# Altium schematic sheet preamp.SchDoc
size A4; SheetNumber: 2; SheetTotal: 3
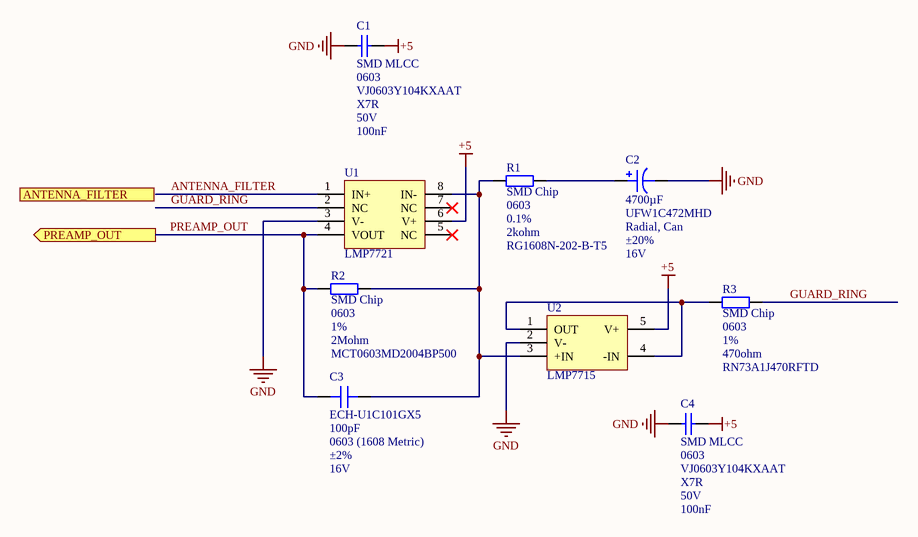
[diagram p0: preamp.SchDoc]

## Parts
C1  SMD MLCC  Size: 0603  Part Number: VJ0603Y104KXAAT  Dielectric: X7R  VoltageRating: 50V  Capacitance: 100nF  [SMD_MLCC_CAPACITOR_0603]
C2  4700µF  Part Number: UFW1C472MHD  Package / Case: Radial, Can  Tolerance: ±20%  Voltage - Rated: 16V  [CAP TH ALUM ELEC D16.00mm S7.50mm H25.00mm]
C3  Part Number: ECH-U1C101GX5  Package / Case: 0603 (1608 Metric)  Tolerance: ±2%  Voltage Rating - DC: 16V  [CAP FILM 0603_1608]  (hidden comment: 100pF)
C4  SMD MLCC  Size: 0603  Part Number: VJ0603Y104KXAAT  Dielectric: X7R  VoltageRating: 50V  Capacitance: 100nF  [SMD_MLCC_CAPACITOR_0603]
R1  SMD Chip  Size: 0603  Tolerance: 0.1%  Resistance: 2kohm  Part Number: RG1608N-202-B-T5  [SMD_CHIP_RESISTOR_0603]
R2  SMD Chip  Size: 0603  Tolerance: 1%  Resistance: 2Mohm  Part Number: MCT0603MD2004BP500  [SMD_CHIP_RESISTOR_0603]
R3  SMD Chip  Size: 0603  Tolerance: 1%  Resistance: 470ohm  Part Number: RN73A1J470RFTD  [SMD_CHIP_RESISTOR_0603]
U1  LMP7721  [LMP7721]
U2  LMP7715  [LMP7715]

## Ports
ANTENNA_FILTER (in), PREAMP_OUT (out)

## Nets
+5: C1.1 C4.1 U1.6(V+) U2.5(V+)
GND: C1.2 C2.2 C4.2 U1.3(V-) U2.2(V-)
ANTENNA_FILTER: U1.1(IN+)
GUARD_RING: R3.2 U1.2(NC)
PREAMP_OUT: C3.1 R2.1 U1.4(VOUT) ; port PREAMP_OUT
NetC2_1: C2.1 R1.2
NetC3_2: C3.2 R1.1 R2.2 U1.8(IN-) U2.3(+IN)
NetR3_1: R3.1 U2.1(OUT) U2.4(-IN)

Not connected (* = marked no-connect by the designer): U1 5(NC)* 7(NC)*

## Library data of the parts
C1 C4 = SMD MLCC Capacitor: generic SMD MLCC capacitor
C2 = UFW1C472MHD: CAP ALUM 4700UF 20% 16V RADIAL; manufacturer: Nichicon; Lifetime @ Temp.: 2000 Hrs @ 85°C; Polarization: Polar; Ripple Current @ High Frequency: 2.415A @ 10kHz; Ripple Current @ Low Frequency: 2.1A @ 120Hz; Applications: Audio; Capacitance: 4700µF; componentlink1description: Datasheet; componentlink1url: http://nichicon-us.com/english/products/pdfs/e-ufw.pdf; componentlink2description: DigiKey Link; componentlink2url: http://digikey.com/product-detail/en/nichicon/UFW1C472MHD/493-3178-ND/1965200; Device Package: Radial, Can; Height - Seated (Max): 0.984" (25.00mm); lastupdated: 2. 09. 2020 01:32:49; Lead Spacing: 0.295" (7.50mm); Lifecycle Status: Active; Minimum Order: 1; Mounting Type: Through Hole; Operating Temperature: -40°C ~ 85°C; packaging: Bulk; partid: 16502; Part Status: Active; price: 1.10; series: UFW; Size / Dimension: 0.630" Dia (16.00mm); Supplier 1: DigiKey; Supplier Part Number 1: 493-3178-ND; value: 4700µF
C3 = ECH-U1C101GX5: CAP FILM 100PF 2% 16VDC 0603; Manufacturer: Panasonic Electronic Components; Dielectric Material: Polyphenylene Sulfide (PPS), Metallized - Stacked; Capacitance: 100pF; Applications: General Purpose; ComponentLink1Description: Datasheet; ComponentLink1URL: http://industrial.panasonic.com/www-cgi/jvcr13pz.cgi?E+PZ+3+ABD0013+ECHU1C101GX5+7+WW; ComponentLink2Description: DigiKey Link; ComponentLink2URL: http://digikey.com/product-detail/en/panasonic-electronic-components/ECH-U1C101GX5/PCF1441CT-ND/431690; Device Package: 0603 (1608 Metric); Height - Seated (Max): 0.033" (0.85mm); LastUpdated: 6. 09. 2020 12:17:15; Lifecycle Status: Active; Minimum Order: 1; Mounting Type: Surface Mount; Operating Temperature: -55°C ~ 125°C; Packaging: TapeAndReel; Part Status: Active; Price: 0.11; Series: ECH-U(X); Size / Dimension: 0.063" L x 0.031" W (1.60mm x 0.80mm); Supplier 1: DigiKey; Supplier Part Number 1: PCF1441CT-ND; Termination: Solder Pads; Value: 100pF
R1-R3 = SMD Chip Resistor: generic SMD chip resistor
U1 = LMP7721: 3-femtoampere input bias current precision amplifier
U2 = LMP7715: Precision, 17 MHz, Low Noise, CMOS Input Amplifier